# Altium schematic sheet 08- Bank2_6_7.SchDoc: Bank 2-6-7
size A3; Page Number: 6; Page Size: B; Page Count: 14; Board Rev: B; Project Name: CrossLink-NX Evaluation Board; RevCode: 1.0; Doc: 305-PD-19-0819; DsnPath: C:\Users\HAltinkilit\Downloads\Crosslink-NX-Design-Files\CrossLink-NX-Eval-Brd-Schematic-RevB-191122.DSN; SchematicName: SCHEMATIC1; PageName: 06 - Serdes SMAs And Switches; PageSize: B; TopSchematic: True
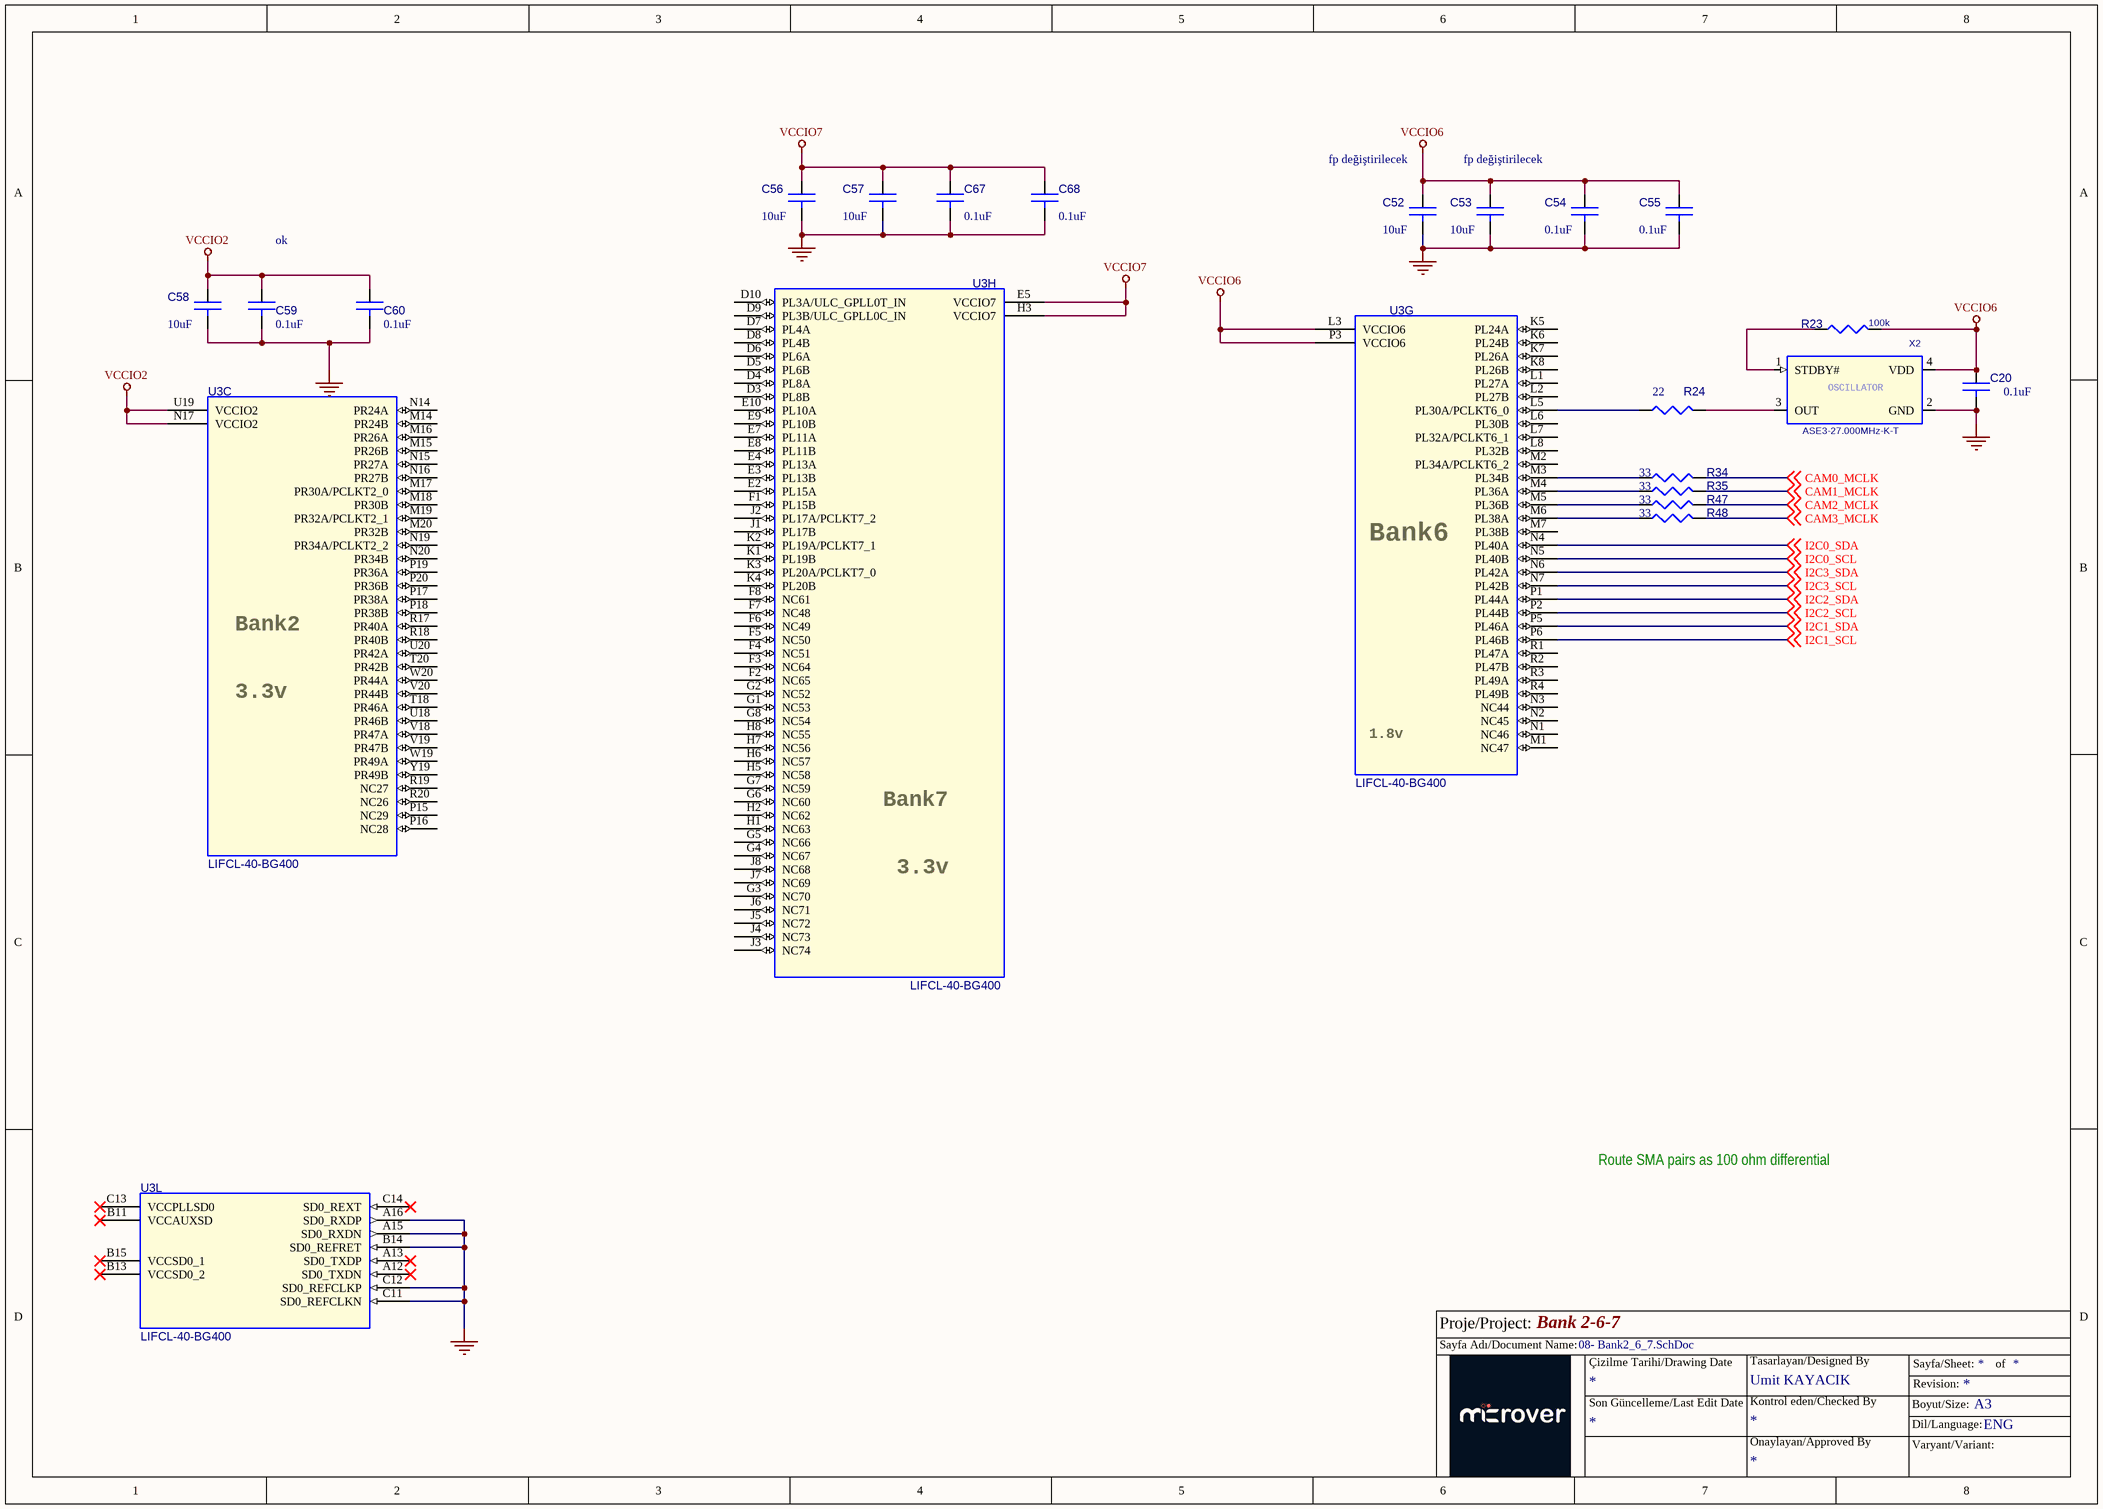
[diagram p0: 08- Bank2_6_7.SchDoc]

## Parts
C20  0.1uF  [C0201]
C52  10uF  [C0603]
C53  10uF  [C0603]
C54  0.1uF  [C0201]
C55  0.1uF  [C0201]
C56  10uF  [C0603]
C57  10uF  [C0603]
C58  10uF  [C0603]
C59  0.1uF  [C0201]
C60  0.1uF  [C0201]
C67  0.1uF  [C0201]
C68  0.1uF  [C0201]
R23  100k  [R0402]
R24  22  [R0402]
R34  33  [R0201]
R35  33  [R0201]
R47  33  [R0201]
R48  33  [R0201]
U3  LIFCL-40-BG400  [LIFCL-40-BG400]  (parts C,G,H,L of 15)
X2  ASE3-27.000MHz-K-T  [27MHZ]

## Nets
GND: C20.2 C52.2 C53.2 C54.2 C55.2 C56.2 C57.2 C58.2 C59.2 C60.2 C67.2 C68.2 U3.A15(SD0_RXDN) U3.A16(SD0_RXDP) U3.B14(SD0_REFRET) U3.C11(SD0_REFCLKN) U3.C12(SD0_REFCLKP) X2.2(GND)
VCCIO2: C58.1 C59.1 C60.1 U3.N17(VCCIO2) U3.U19(VCCIO2)
VCCIO6: C20.1 C52.1 C53.1 C54.1 C55.1 R23.2 U3.L3(VCCIO6) U3.P3(VCCIO6) X2.4(VDD)
VCCIO7: C56.1 C57.1 C67.1 C68.1 U3.E5(VCCIO7) U3.H3(VCCIO7)
CAM0_MCLK: R34.2 ; off-sheet CAM0_MCLK
CAM1_MCLK: R35.2 ; off-sheet CAM1_MCLK
CAM2_MCLK: R47.2 ; off-sheet CAM2_MCLK
CAM3_MCLK: R48.2 ; off-sheet CAM3_MCLK
I2C0_SCL: U3.N5(PL40B) ; off-sheet I2C0_SCL
I2C0_SDA: U3.N4(PL40A) ; off-sheet I2C0_SDA
I2C1_SCL: U3.P6(PL46B) ; off-sheet I2C1_SCL
I2C1_SDA: U3.P5(PL46A) ; off-sheet I2C1_SDA
I2C2_SCL: U3.P2(PL44B) ; off-sheet I2C2_SCL
I2C2_SDA: U3.P1(PL44A) ; off-sheet I2C2_SDA
I2C3_SCL: U3.N7(PL42B) ; off-sheet I2C3_SCL
I2C3_SDA: U3.N6(PL42A) ; off-sheet I2C3_SDA
NetR23_1: R23.1 X2.1(STDBY#)
NetR24_1: R24.1 X2.3(OUT)
NetR24_2: R24.2 U3.L5(PL30A/PCLKT6_0)
NetR34_1: R34.1 U3.M3(PL34B)
NetR35_1: R35.1 U3.M4(PL36A)
NetR47_1: R47.1 U3.M5(PL36B)
NetR48_1: R48.1 U3.M6(PL38A)

Not connected (* = marked no-connect by the designer): U3 A12(SD0_TXDN)* A13(SD0_TXDP)* B11(VCCAUXSD)* B13(VCCSD0_2)* B15(VCCSD0_1)* C13(VCCPLLSD0)* C14(SD0_REXT)* D3(PL8B) D4(PL8A) D5(PL6B) D6(PL6A) D7(PL4A) D8(PL4B) D9(PL3B/ULC_GPLL0C_IN) D10(PL3A/ULC_GPLL0T_IN) E2(PL15A) E3(PL13B) E4(PL13A) E7(PL11A) E8(PL11B) E9(PL10B) E10(PL10A) F1(PL15B) F2(NC65) F3(NC64) F4(NC51) F5(NC50) F6(NC49) F7(NC48) F8(NC61) G1(NC53) G2(NC52) G3(NC70) G4(NC67) G5(NC66) G6(NC60) G7(NC59) G8(NC54) H1(NC63) H2(NC62) H5(NC58) H6(NC57) H7(NC56) H8(NC55) J1(PL17B) J2(PL17A/PCLKT7_2) J3(NC74) J4(NC73) J5(NC72) J6(NC71) J7(NC69) J8(NC68) K1(PL19B) K2(PL19A/PCLKT7_1) K3(PL20A/PCLKT7_0) K4(PL20B) K5(PL24A) K6(PL24B) K7(PL26A) K8(PL26B) L1(PL27A) L2(PL27B) L6(PL30B) L7(PL32A/PCLKT6_1) L8(PL32B) M1(NC47) M2(PL34A/PCLKT6_2) M7(PL38B) M14(PR24B) M15(PR26B) M16(PR26A) M17(PR30A/PCLKT2_0) M18(PR30B) M19(PR32A/PCLKT2_1) M20(PR32B) N1(NC46) N2(NC45) N3(NC44) N14(PR24A) N15(PR27A) N16(PR27B) N19(PR34A/PCLKT2_2) N20(PR34B) P15(NC29) P16(NC28) P17(PR38A) P18(PR38B) P19(PR36A) P20(PR36B) R1(PL47A) R2(PL47B) R3(PL49A) R4(PL49B) R17(PR40A) R18(PR40B) R19(NC27) R20(NC26) T18(PR46A) T20(PR42B) U18(PR46B) U20(PR42A) V18(PR47A) V19(PR47B) V20(PR44B) W19(PR49A) W20(PR44A) Y19(PR49B)

## Notes on the sheet
- (near C52) fp değiştirilecek
- fp değiştirilecek
- ok
- (near X2) OSCILLATOR
- (near U3) Bank6
- (near U3) Bank2
- (near U3) 3.3v
- (near U3) 1.8v
- (near U3) Bank7
- Route SMA pairs as 100 ohm differential
- Proje/Project:
- Sayfa Adı/Document Name:
- Çizilme Tarihi/Drawing Date
- Umit KAYACIK
- Tasarlayan/Designed By
- Sayfa/Sheet:
- Revision:
- of
- Son Güncelleme/Last Edit Date
- Kontrol eden/Checked By
- Onaylayan/Approved By
- Boyut/Size:
- Varyant/Variant:
- Dil/Language:
- A3
- ENG

## Library data of the parts
C20 = 0u1_0402: CAP CER 0.1UF 25V 10% X5R 0201; Manufacturer: Murata; Manufacturer Part Number: GRM033R61E104KE14J; Part Reference: C20; Class: Discrete; Digikey P/N: 399-3521-2-ND; Assy: -; Value: 0.1uF; PCB Footprint: C0201
C52 = 10uF_0603: CAP CECAP CER 10UF 10V X5R 20% 0603; Manufacturer: Taiyo Yuden; Manufacturer Part Number: LMK107BJ106MALTD; Part Reference: C39; Class: Discrete; Digikey P/N: 587-2562-1-ND; Assy: -; Value: 10uF; PCB Footprint: C0603
C53 = 0u1_0402: CAP CECAP CER 10UF 10V X5R 20% 0603; Manufacturer: Taiyo Yuden; Manufacturer Part Number: LMK107BJ106MALTD; Part Reference: C40; Class: Discrete; Digikey P/N: 399-3521-2-ND; Assy: -; Value: 10uF; PCB Footprint: C0603
C54 = 0u1_0402: CAP CER 0.1UF 25V 10% X5R 0201; Manufacturer: Murata; Manufacturer Part Number: GRM033R61E104KE14J; Part Reference: C41; Class: Discrete; Digikey P/N: 399-3521-2-ND; Assy: -; Value: 0.1uF; PCB Footprint: C0201
C55 = 0u1_0402: CAP CER 0.1UF 25V 10% X5R 0201; Manufacturer: Murata; Manufacturer Part Number: GRM033R61E104KE14J; Part Reference: C42; Class: Discrete; Digikey P/N: 399-3521-2-ND; Assy: -; Value: 0.1uF; PCB Footprint: C0201
C56 = 10uF_0603: CAP CECAP CER 10UF 10V X5R 20% 0603; Manufacturer: Taiyo Yuden; Manufacturer Part Number: LMK107BJ106MALTD; Part Reference: C68; Class: Discrete; Digikey P/N: 587-2562-1-ND; Assy: -; Value: 10uF; PCB Footprint: C0603
C57 = 10uF_0603: CAP CECAP CER 10UF 10V X5R 20% 0603; Manufacturer: Taiyo Yuden; Manufacturer Part Number: LMK107BJ106MALTD; Part Reference: C69; Class: Discrete; Digikey P/N: 587-2562-1-ND; Assy: -; Value: 10uF; PCB Footprint: C0603
C58 = 10uF_0603: CAP CECAP CER 10UF 10V X5R 20% 0603; Manufacturer: Taiyo Yuden; Manufacturer Part Number: LMK107BJ106MALTD; Part Reference: C58; Class: Discrete; Digikey P/N: 587-2562-1-ND; Assy: -; Value: 10uF; PCB Footprint: C0603
C59 = 0u1_0402: CAP CER 0.1UF 25V 10% X5R 0201; Manufacturer: Murata; Manufacturer Part Number: GRM033R61E104KE14J; Part Reference: C59; Class: Discrete; Digikey P/N: 399-3521-2-ND; Assy: -; Value: 0.1uF; PCB Footprint: C0201
C60 = 0u1_0402: CAP CER 0.1UF 25V 10% X5R 0201; Manufacturer: Murata; Manufacturer Part Number: GRM033R61E104KE14J; Part Reference: C60; Class: Discrete; Digikey P/N: 399-3521-2-ND; Assy: -; Value: 0.1uF; PCB Footprint: C0201
C67 = 0u1_0402: CAP CER 0.1UF 25V 10% X5R 0201; Manufacturer: Murata; Manufacturer Part Number: GRM033R61E104KE14J; Part Reference: C70; Class: Discrete; Digikey P/N: 399-3521-2-ND; Assy: -; Value: 0.1uF; PCB Footprint: C0201
C68 = 0u1_0402: CAP CER 0.1UF 25V 10% X5R 0201; Manufacturer: Murata; Manufacturer Part Number: GRM033R61E104KE14J; Part Reference: C71; Class: Discrete; Digikey P/N: 399-3521-2-ND; Assy: -; Value: 0.1uF; PCB Footprint: C0201
R23 = RES_100K_1W16_0402_5P: RES 100K OHM 1/10W 1% 0402 SMD; Part Reference: R23; Unit Price (USD): 0.02; Total Area(sq-mm): 0.5; Wattage: 1/16W; DIST: FLAT; MAX_TEMP: RTMAX; MFG P/N: ERJ-2RKF1003X; MFG: Panasonic; TC1: 0; Length(mm): 1; Width(mm): 0.5; TC2: 0; Value: 100k; Manufacturer Part Number: ERJ-2RKF1003X; Manufacturer: Panasonic; PART_NUMBER: ERJ-2RKF1003X; Assy: -; PCB Footprint: R0402
R24 = 0R_0603: RES SMD 22 OHM 1% 1/10W 0402; Manufacturer: Panasonic; Manufacturer Part Number: ERJ-2RKF22R0X; Part Reference: R24; Class: Discrete; Digikey P/N: 311-0.0GRTR-ND; Assy: -; Value: 22; MFG P/N: ERJ-2RKF22R0X; MFG: Panasonic; PCB Footprint: R0402
R34 R35 R47 R48 = 0R_0603: RES SMD 33 OHM 1% 1/10W; Manufacturer: Panasonic; Manufacturer Part Number: ERJ-2RKF33R0X; Part Reference: R5; Class: Discrete; PCB Footprint: R0402; Digikey P/N: 311-0.0GRTR-ND; Assy: -; Value: 33
U3 = LIFCL-40-BG400: Part Reference: U3; Source Part: LIFCL-40-BG400A.Normal; SWAP_INFO: (S1+S2+S3+S4+S5+S6+S7+S8+S9+S10+S11+S12+S13+S14+S15); SPLIT_INST: TRUE; Name: I17266603; Primitive: DEFAULT; Implementation Type: <none>; Location X-Coordinate: 0; Source Library: C:\USERS\SLIU1\DOCUMENTS\PCB_DESIGN\JEDI_EVAL_BOARD\SCHEMATIC\LIFCL40.OLB; Power Pins Visible: False; Value: LIFCL-40-BG400; Assy: -; Location Y-Coordinate: 0; Color: Default; Source Package: LIFCL-40-BG400; Graphic: LIFCL-40-BG400A.Normal; PCB Footprint: LIFCL-40-BG400
X2 = OSC_25MHz_10PPM: Standard Clock Oscillators 27.000M 1.8V 30ppm; Part Reference: X2; Manufacturer: ABRACON; MFG: Abracon Corporation; Total Area(sq-mm): 16.83; MFG P/N: ASFLMB-25.000MHZ-LY-T; Unit Price (USD): 1.96; Length(mm: 5.1; Width(mm): 3.3; Value: ASE3-27.000MHz-K-T; Assy: -; Manufacturer Part Number: ASE3-27.000MHz-K-T; PCB Footprint: 27MHZ